# EAGLE design power_Rev_2 (EAGLE 9.0.1)
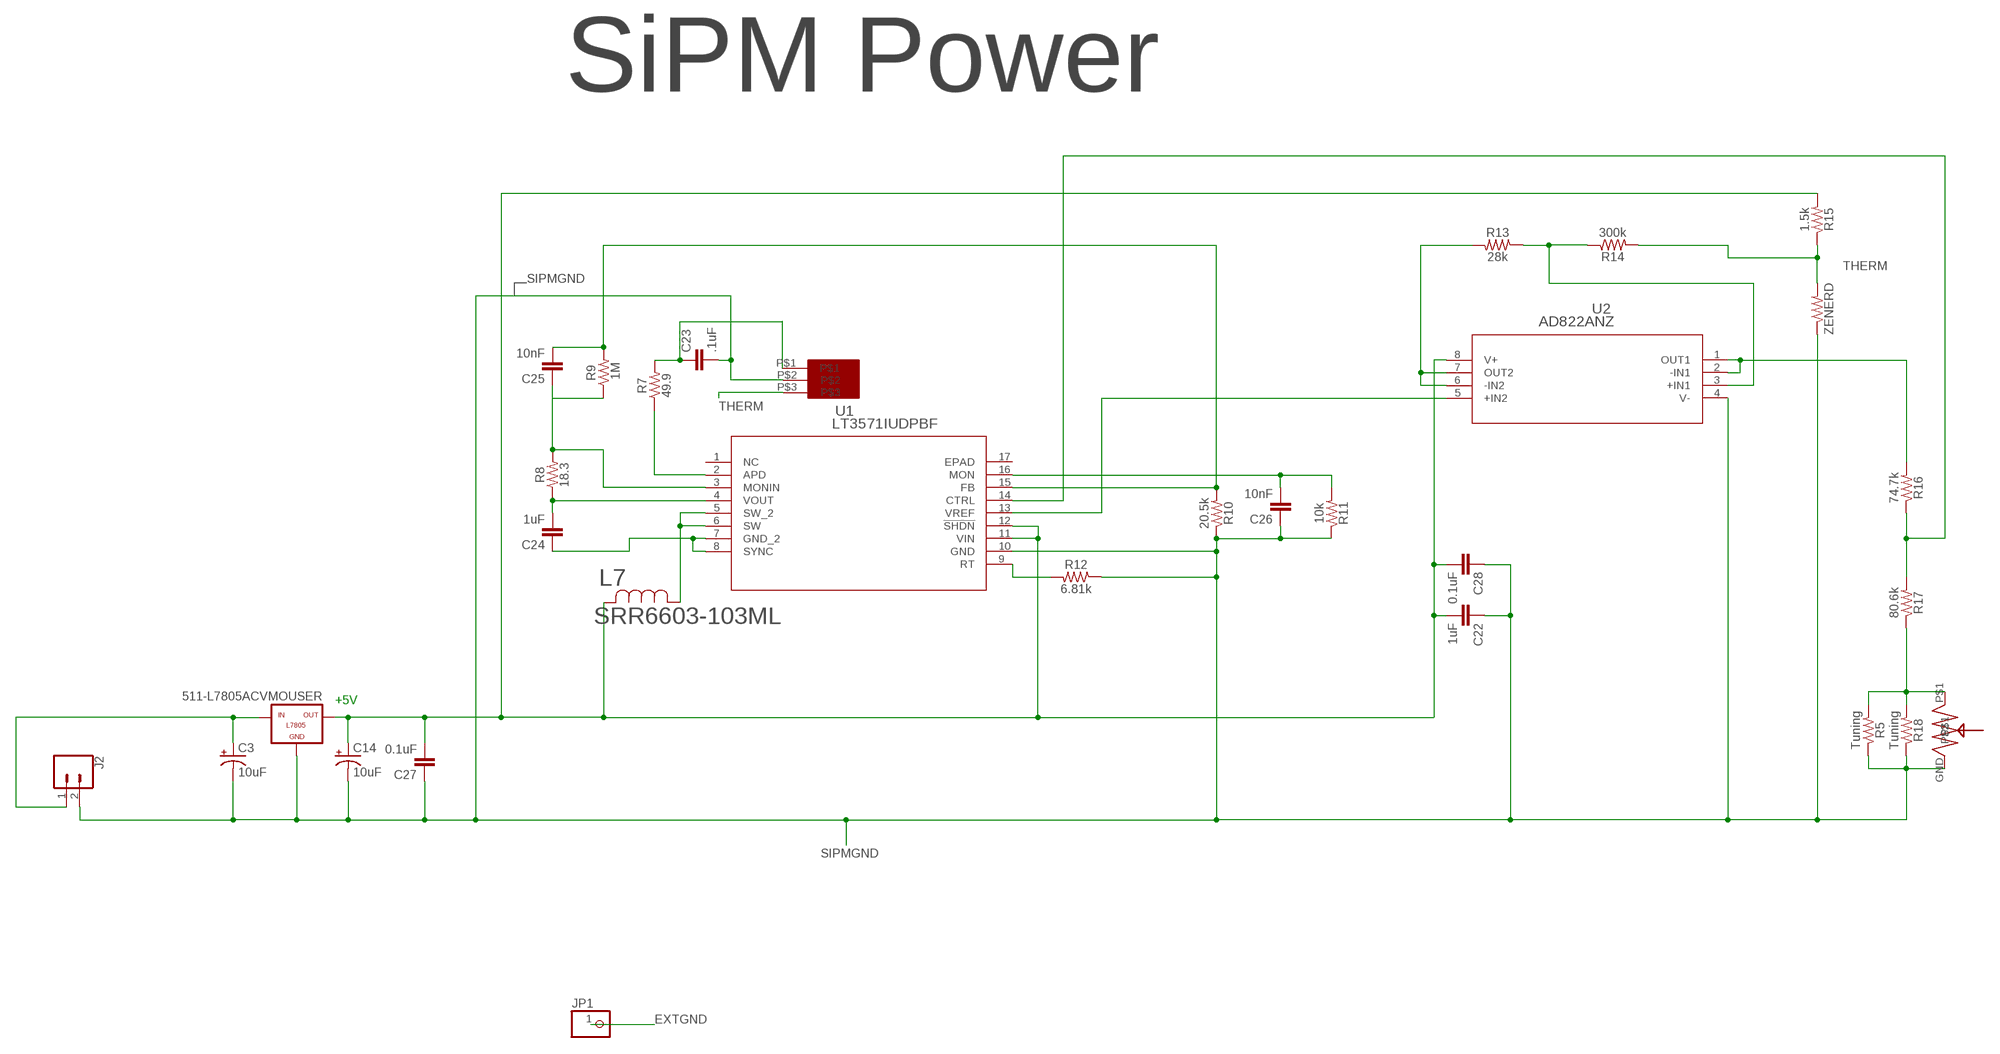
[diagram p0: schematic, sheet 1, part 1 of 2]
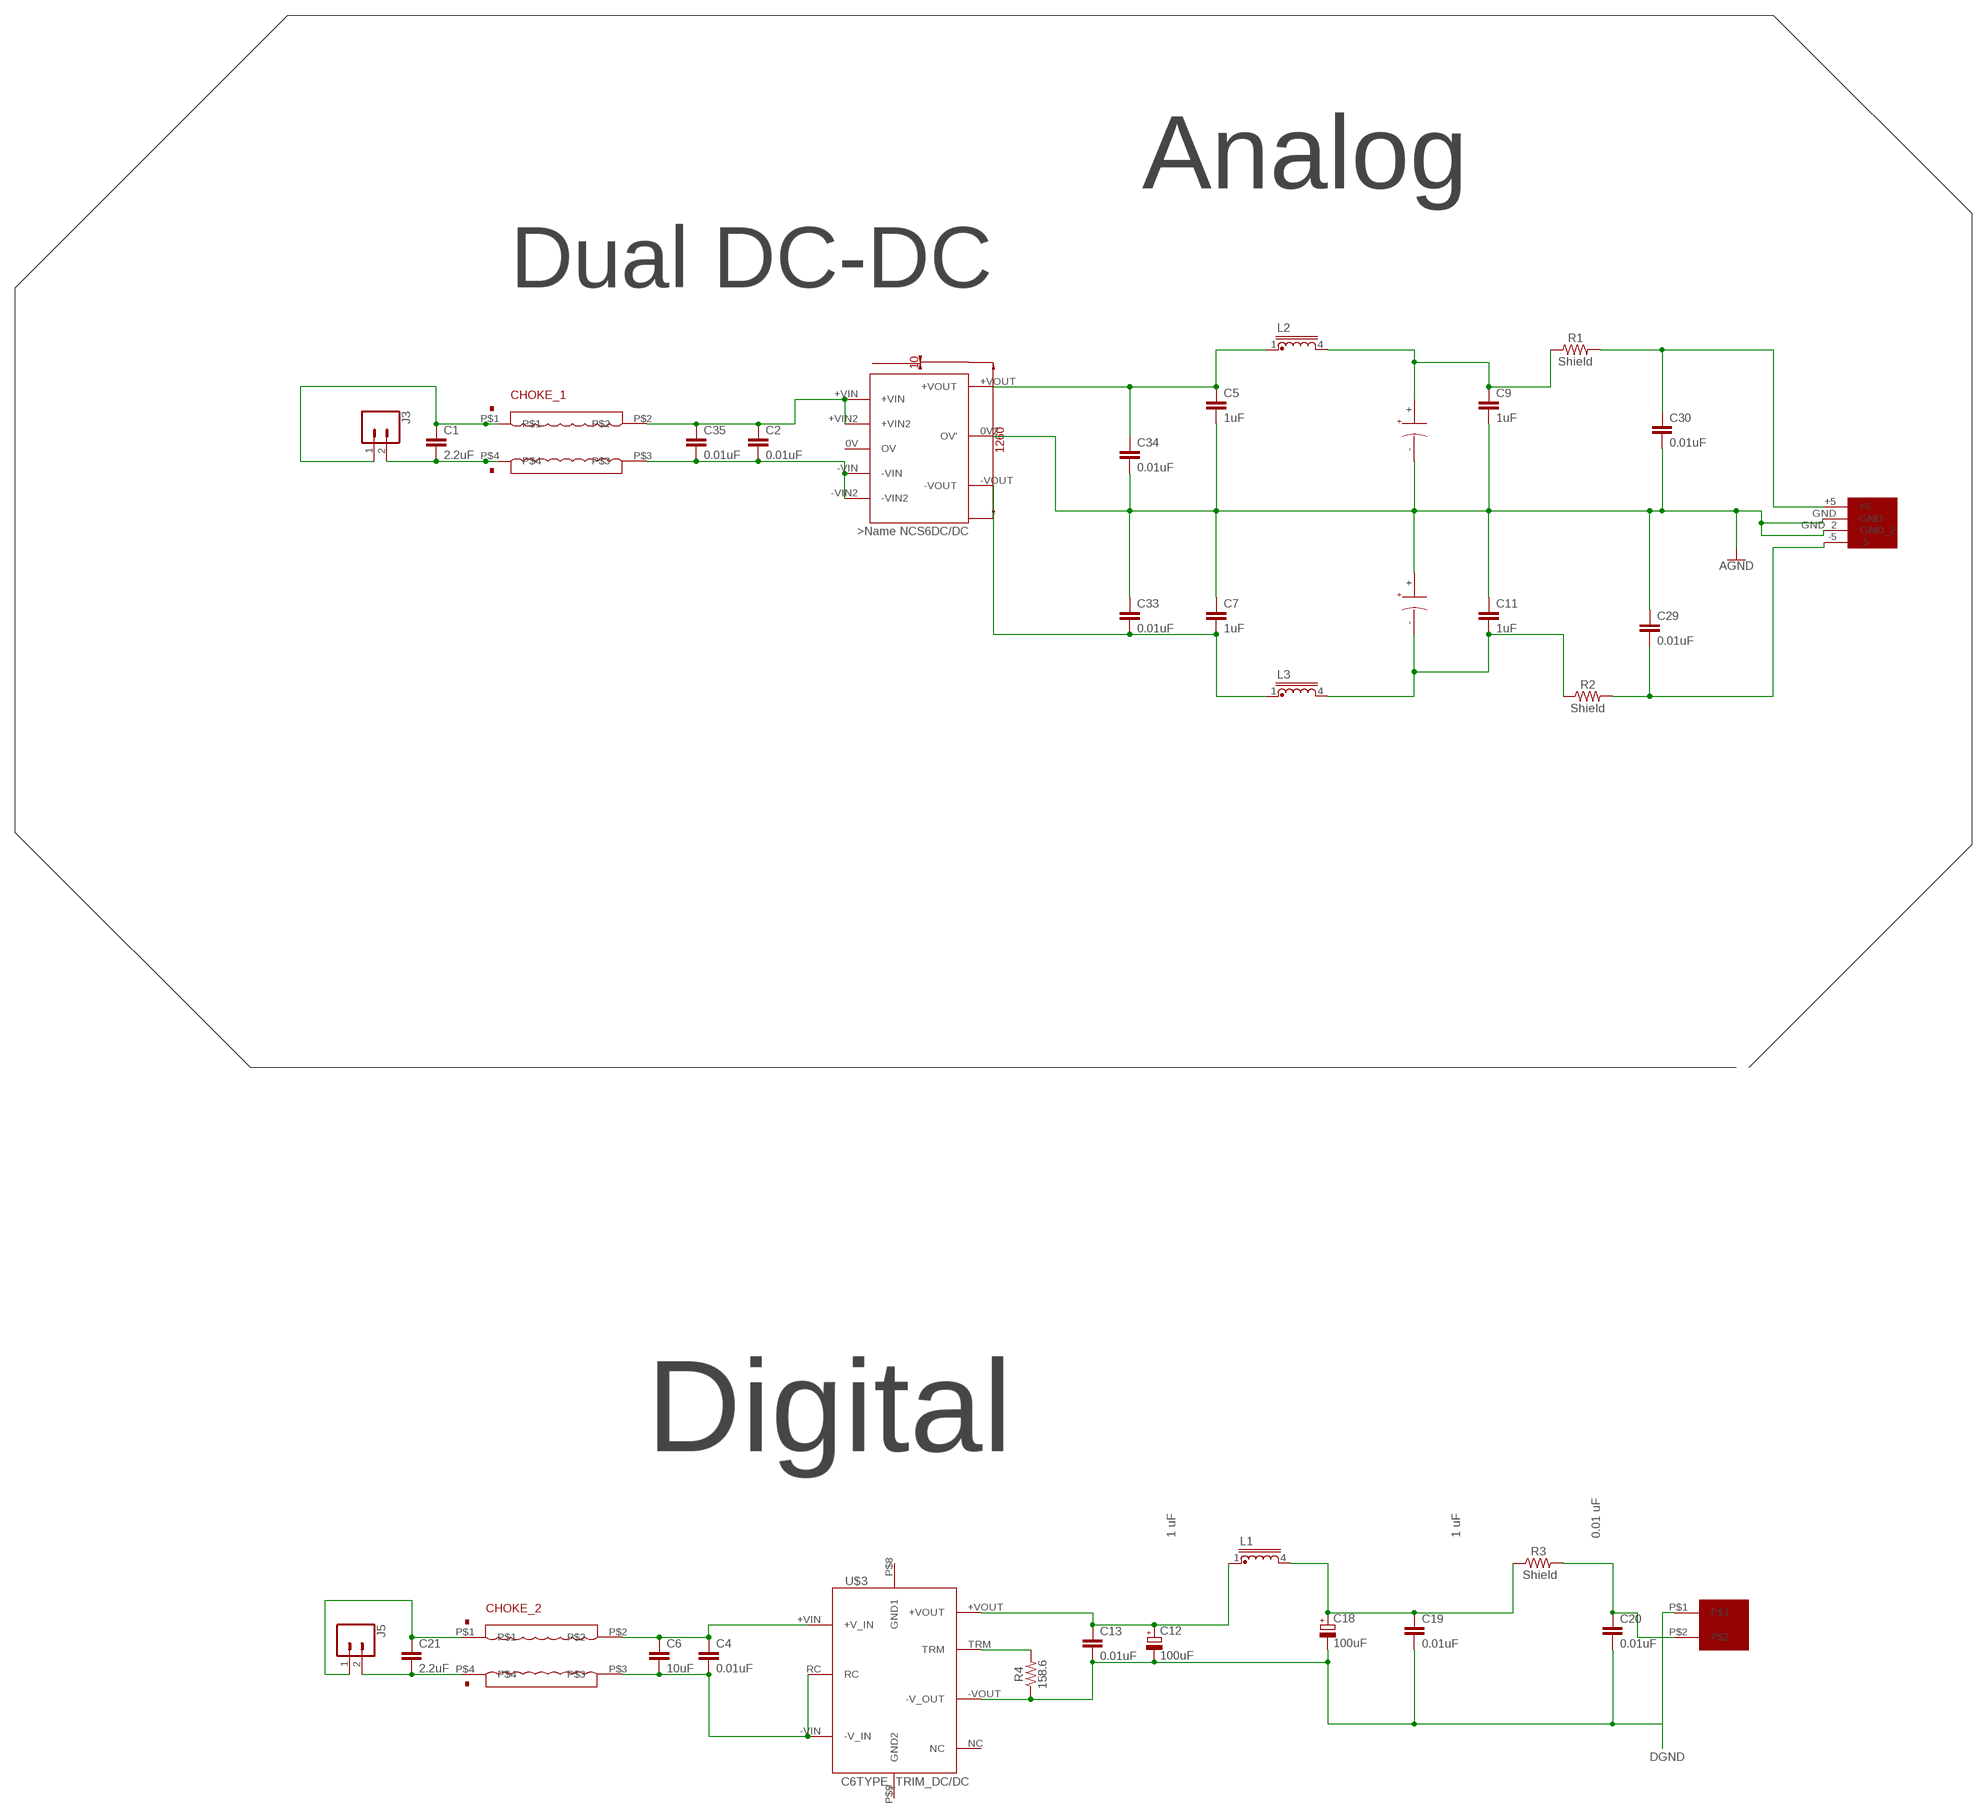
[diagram p1: schematic, sheet 1, part 2 of 2]

## Parts
511-L7805ACVMOUSER  -L7805  [L7805]
C1  2.2uF  C-EU050-024X044  [C050-024X044]
C2  0.01uF  C-EU025-025X050  [C025-025X050]
C3  10uF  CPOL-USB/3528-21R  [T/3528-12R]
C4  0.01uF  C-EU025-025X050  [C025-025X050]
C5  1uF  C-EU025-025X050  [C025-025X050]
C6  10uF  C-EU025-025X050  [C025-025X050]
C7  1uF  C-EU025-025X050  [C025-025X050]
C8  150uF  399-4567-ND  [399-3567-ND150UF]
C9  1uF  C-EU025-025X050  [C025-025X050]
C10  150uF  399-4567-ND  [399-3567-ND150UF]
C11  1uF  C-EU025-025X050  [C025-025X050]
C12  100uF  CPOL-EUC/6032-28R  [C/6032-28R]
C13  0.01uF  C-EU025-025X050  [C025-025X050]
C14  10uF  CPOL-USB/3528-21R  [T/3528-12R]
C18  100uF  CPOL-EUC/6032-28R  [C/6032-28R]
C19  0.01uF  C-EU025-025X050  [C025-025X050]
C20  0.01uF  C-EU025-025X050  [C025-025X050]
C21  2.2uF  C-EU050-024X044  [C050-024X044]
C22  1uF  C-EU025-025X050  [C025-025X050]
C23  .1uF  C2.5/2  [C2.5-2]
C24  1uF  C-EU025-025X050  [C025-025X050]
C25  10nF  C2.5/2  [C2.5-2]
C26  10nF  C2.5/2  [C2.5-2]
C27  0.1uF  C2.5/2  [C2.5-2]
C28  0.1uF  C2.5/2  [C2.5-2]
C29  0.01uF  C-EUC0603  [C0603]
C30  0.01uF  C-EUC0603  [C0603]
C33  0.01uF  C-EUC0603  [C0603]
C34  0.01uF  C-EUC0603  [C0603]
C35  0.01uF  C-EUC0603  [C0603]
CHOKE_1  DN4730-ND  [DN4730-ND]
CHOKE_2  DN4730-ND  [DN4730-ND]
J2  CONN_023.5MM  [SCREWTERMINAL-3.5MM-2]
J3  CONN_023.5MM  [SCREWTERMINAL-3.5MM-2]
J5  CONN_023.5MM  [SCREWTERMINAL-3.5MM-2]
JP1  PINHD-1X1  [1X01]
L1  U15-CHOKE  [U15CHOKE]
L2  U15-CHOKE  [U15CHOKE]
L3  U15-CHOKE  [U15CHOKE]
L7  SRR6603-103ML  [IND_BOURNS_SRR6603]
PWR_JACK  WM403_NDPOWER_JACK  [WM4302-ND]
R1  Shield  RESISTORAXIAL-0.3  [AXIAL-0.3]
R2  Shield  RESISTORAXIAL-0.3  [AXIAL-0.3]
R3  Shield  RESISTORAXIAL-0.3  [AXIAL-0.3]
R4  158.6  RESISTORAXIAL-0.3  [AXIAL-0.3]
R5  Tuning  RESISTORAXIAL-0.3  [AXIAL-0.3]
R7  49.9  RESISTORAXIAL-0.3  [AXIAL-0.3]
R8  18.3  RESISTORAXIAL-0.3  [AXIAL-0.3]
R9  1M  RESISTORAXIAL-0.3  [AXIAL-0.3]
R10  20.5k  RESISTORAXIAL-0.3  [AXIAL-0.3]
R11  10k  10KOHM-HORIZ-1/4W-1%  [AXIAL-0.3]
R12  6.81k  RESISTORAXIAL-0.3  [AXIAL-0.3]
R13  28k  RESISTORAXIAL-0.3  [AXIAL-0.3]
R14  300k  RESISTORAXIAL-0.3  [AXIAL-0.3]
R15  1.5k  RESISTORAXIAL-0.3  [AXIAL-0.3]
R16  74.7k  RESISTORAXIAL-0.3  [AXIAL-0.3]
R17  80.6k  RESISTORAXIAL-0.3  [AXIAL-0.3]
R18  Tuning  RESISTORAXIAL-0.3  [AXIAL-0.3]
U1  LT3571IUDPBF  [QFN-16_UD]
U2  AD822ANZ  [N_8]
U$1  NCS6D1205  [NCS6D1205C]
U$3  C6TYPE_TRIM_DC/DC  [CONV/DC/DC_6W_SNGL_C6TYPE]
U$4  WM4300-ND_2PIN  [WM4300-ND_2PIN]
U$5  WM4301-ND_3PIN  [WM4301-ND_3PIN]
VAR1  10KTRIM_POT  [10KTRIM_POT]
ZENERD  RESISTORAXIAL-0.3  [AXIAL-0.3]

## Nets
5VSUPPLY: 511-L7805ACVMOUSER.OUT C14.+ C22.2 C27.2 C28.2 L7.2 R15.P$2 U1.11(VIN) U1.12(!SHDN) U2.8(V+)
+VOUT: C18.+ C19.1 L1.4 R3.P$1
+VOUT': C12.+ C13.1 L1.1 U$3.+VOUT
+VOUT'': C20.1 R3.P$2 U$4.P$2
-FINV: C30.1 PWR_JACK.+5 R1.P$2
AGND: C5.2 C7.1 C8.-(N) C9.2 C10.+(P) C11.1 C29.1 C30.2 C33.1 C34.2 PWR_JACK.GND PWR_JACK.GND_2 U$1.0V2(OV')
DGND: C12.- C13.2 C18.- C19.2 C20.2 R4.P$1 U$3.-VOUT(-V_OUT) U$4.P$1
EXTGND: JP1.1
N$1: C1.1 CHOKE_1.P$1 J3.1
N$2: C1.2 CHOKE_1.P$4 J3.2
N$3: C7.2 C33.2 L3.1 U$1.-VOUT
N$4: C2.1 C35.1 CHOKE_1.P$2 U$1.+VIN U$1.+VIN2
N$6: C8.+(P) C9.1 L2.4 R1.P$1
N$7: R13.P$2 U2.6(-IN2) U2.7(OUT2)
N$8: C10.-(N) C11.2 L3.4 R2.P$1
N$9: C29.2 PWR_JACK.-5 R2.P$2
N$10: C21.1 CHOKE_2.P$1 J5.1
N$11: C21.2 CHOKE_2.P$4 J5.2
N$12: C4.1 C6.1 CHOKE_2.P$2 U$3.+VIN(+V_IN)
N$13: C4.2 C6.2 CHOKE_2.P$3 U$3.-VIN(-V_IN) U$3.RC
N$14: C24.2 R8.P$1 U1.4(VOUT)
N$16: R4.P$2 U$3.TRM
N$18: C24.1 U1.7(GND_2) U1.8(SYNC)
N$20: R7.P$1 U1.2(APD)
N$21: C23.1 R7.P$2 U$5.P$1
N$22: C25.1 R8.P$2 R9.P$1 U1.3(MONIN)
N$23: C26.2 R11.P$2 U1.16(MON)
N$24: L7.1 U1.5(SW_2) U1.6(SW)
N$25: U1.13(VREF) U2.5(+IN2)
N$26: C5.1 C34.1 L2.1 U$1.+VOUT
N$27: R16.P$2 U2.1(OUT1) U2.2(-IN1)
N$28: C25.2 R9.P$2 R10.P$2 U1.15(FB)
N$29: R13.P$1 R14.P$1 U2.3(+IN1)
N$30: R12.P$2 U1.9(RT)
N$33: R16.P$1 R17.P$2 U1.14(CTRL)
N$34: R5.P$2 R17.P$1 R18.P$2 VAR1.P$1
N$35: C2.2 C35.2 CHOKE_1.P$3 U$1.-VIN U$1.-VIN2
N$36: 511-L7805ACVMOUSER.IN C3.+ J2.1
SIPMGND: 511-L7805ACVMOUSER.GND C3.- C14.- C22.1 C23.2 C26.1 C27.1 C28.1 J2.2 R5.P$1 R10.P$1 R11.P$1 R12.P$1 R18.P$1 U1.10(GND) U2.4(V-) U$5.P$2 VAR1.GND ZENERD.P$1
THERM: R14.P$2 R15.P$1 U$5.P$3 ZENERD.P$2
Unconnected: U1.1(NC) U1.17(EPAD) U$1.0V(OV) U$3.NC U$3.P$8(GND1) U$3.P$9(GND2)

## Notes on the sheet
- SiPM Power
- +5V
- Analog
- Dual DC-DC
- Digital
- 1 uF | 1 uF
- 0.01 uF

## Library data of the parts
511-L7805ACVMOUSER = tango:-L7805; OC_NEWARK: unknown
C1 C2 C4-C7 C9 C11 C13 C19-C22 C24 = resistor:C-EU: CAPACITOR, European symbol; OC_NEWARK: unknown
C3 C14 = resistor:CPOL-US: POLARIZED CAPACITOR, American symbol
C8 C10 = 399-3567-ND150uF:399-4567-ND
C12 = resistor:CPOL-EU: POLARIZED CAPACITOR, European symbol; OC_NEWARK: unknown
C18 = resistor:CPOL-EU: POLARIZED CAPACITOR, European symbol; OC_NEWARK: unknown; SPICEPREFIX: C
C23 C25-C28 = capacitor-wima:C: CAPACITOR naming: grid - package width; OC_NEWARK: unknown
C29 C30 C33-C35 = resistor:C-EU: CAPACITOR, European symbol
CHOKE_1 CHOKE_2 = DN4730-ND_Com_Choke:DN4730-ND: Surface Mount Common Mode Choke Digikey: DN4730-ND 100uH
J2 J3 J5 = SparkFun-Connectors:CONN_02: Multi connection point. Often used as Generic Header-pin footprint for 0.1 inch spaced/style header connections On any of the 0.1 inch spaced packages, you can populate with these: Break Away Headers - Straight <https://www.sparkfun.com/products/116> (PRT-00116) Break Away Male Headers - Right Angle <https://www.sparkfun.com/products/553> (PRT-00553) Female Headers <https://www.sparkfun.com/products/115> (PRT-00115) Break Away Headers - Machine Pin <https://www.sparkfun.com/products/117> (PRT-00117) Break Away Female Headers - Swiss Machine Pin <https://www.sparkfun.com/products/743> (PRT-00743) For SCREWTERMINALS and SPRING TERMINALS visit here: Screw Terimnals on SparkFun.com <https://www.sparkfun.com/search/results?term=Screw+Terminals> (5mm/3.5mm/2.54mm spacing) This device is also useful as a general connection point to wire up your design to another part of your project. Our various solder wires solder well into these plated through hole pads. Hook-Up Wire - Assortment (Stranded, 22 AWG) <https://www.sparkfun.com/products/11375> (PRT-11375) Hook-Up Wire - Assortment (Solid Core, 22 AWG) <https://www.sparkfun.com/products/11367> (PRT-11367) View the entire wire category on our website here <https://www.sparkfun.com/categories/141> Special notes: Molex polarized connector foot print use with: PRT-08233 with associated crimp pins and housings. 2.54_SCREWTERM for use with PRT-10571. 3.5mm Screw Terminal footprints for PRT-08084 5mm Screw Terminal footprints for use with PRT-08432; PROD_ID: CONN-08399
JP1 = adafruit:PINHD-1X1: Pin header 1x1 for 0.1" spacing With round pins; OC_NEWARK: unknown
L1-L3 = inductor-neosid:U15-: CHOKE U15; OC_FARNELL: unknown; OC_NEWARK: unknown
L7 = SRR6603-10MLTR-ND:SRR6603-103ML; MANUFACTURER_PART_NUMBER: SRR6603103ML; OC_NEWARK: unknown; VENDOR: Bourns Electronics
PWR_JACK = WM4302-ND:WM403_ND; OC_NEWARK: unknown
R1-R5 R7-R10 R12-R18 ZENERD = SparkFun-Resistors:RESISTOR: Generic Resistor Package; OC_NEWARK: unknown
R11 = SparkFun-Resistors:10KOHM: 10kΩ resistor A resistor is a passive two-terminal electrical component that implements electrical resistance as a circuit element. Resistors act to reduce current flow, and, at the same time, act to lower voltage levels within circuits. - Wikipedia; OC_NEWARK: unknown; PROD_ID: RES-12183
U1 = LT3571:LT3571IUDPBF; MANUFACTURER_PART_NUMBER: LT3571IUD#PBF; OC_NEWARK: unknown; VENDOR: Linear Technology
U2 = AD822ANZ_opAmp:AD822ANZ; MANUFACTURER_PART_NUMBER: AD822ANZ; OC_NEWARK: unknown; VENDOR: Analog Devices Inc
U$1 = LAFTRPWR:NCS6D1205: NCS6 DC/DC converter; OC_NEWARK: unknown
U$3 = DCDC_Trim:C6TYPE_TRIM_DC/DC; OC_NEWARK: unknown
U$4 = WM4300-ND_2PIN:WM4300-ND_2PIN
U$5 = WM4301-ND_3PIN:WM4301-ND_3PIN
VAR1 = 10kTrimPot:10KTRIM_POT

## Board
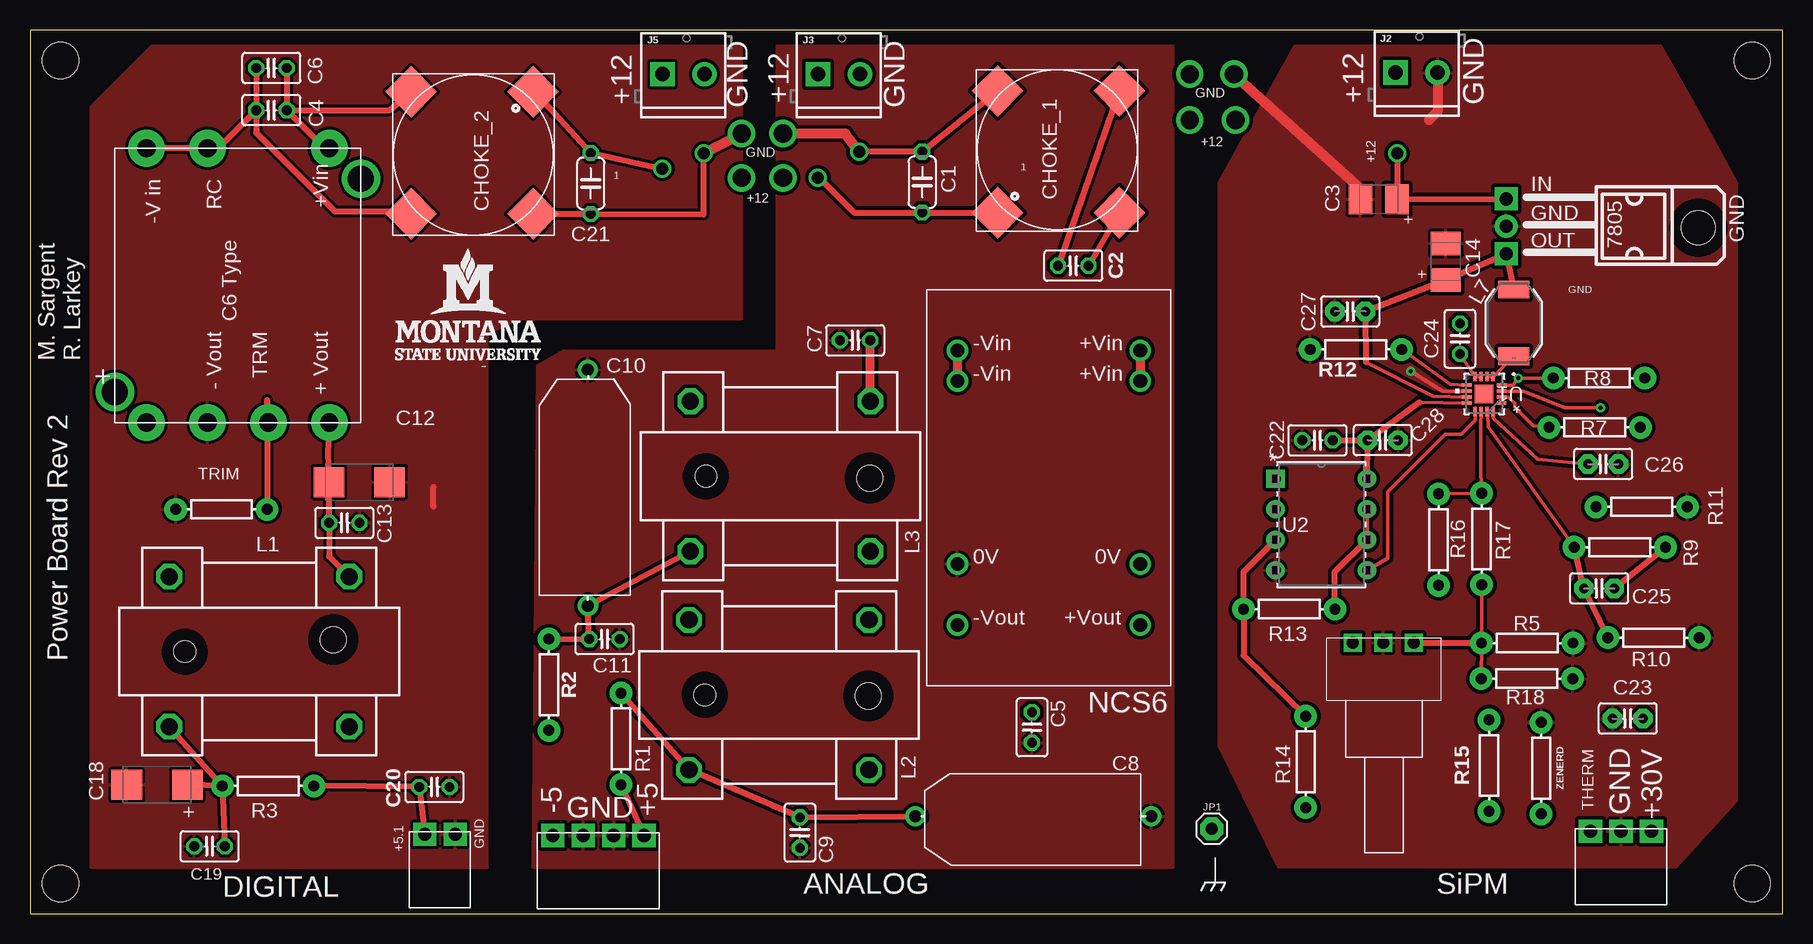
[diagram p2: board, top side]
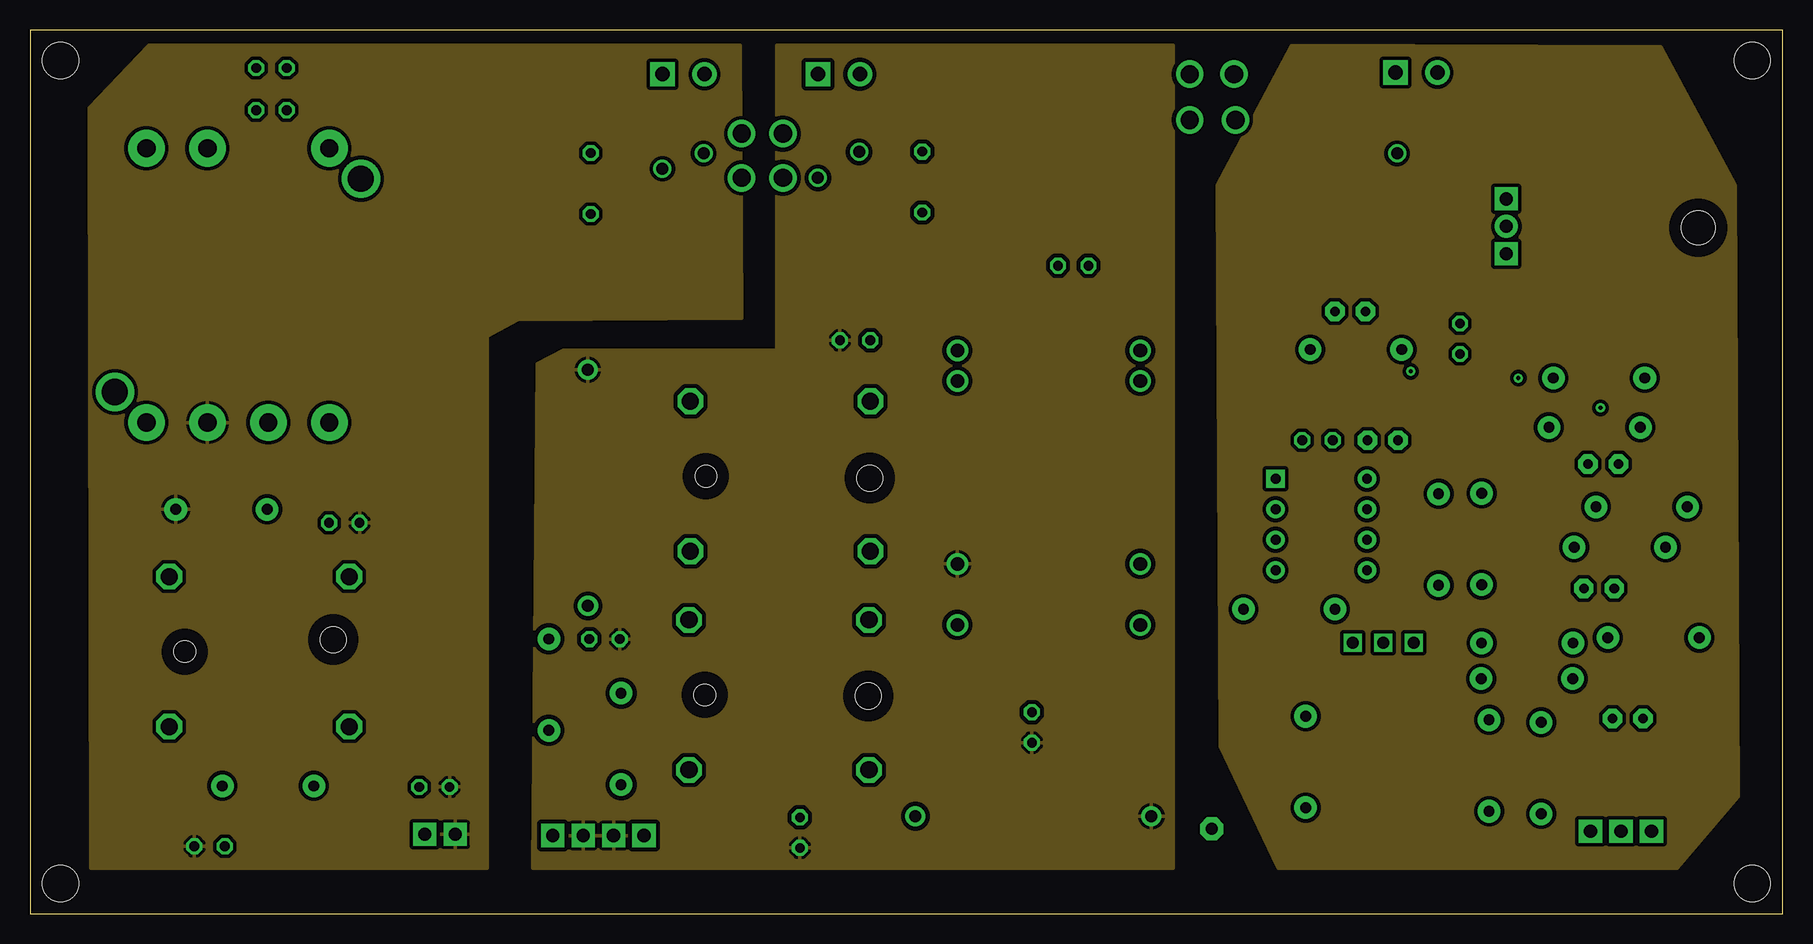
[diagram p3: board, inner layer Route2]
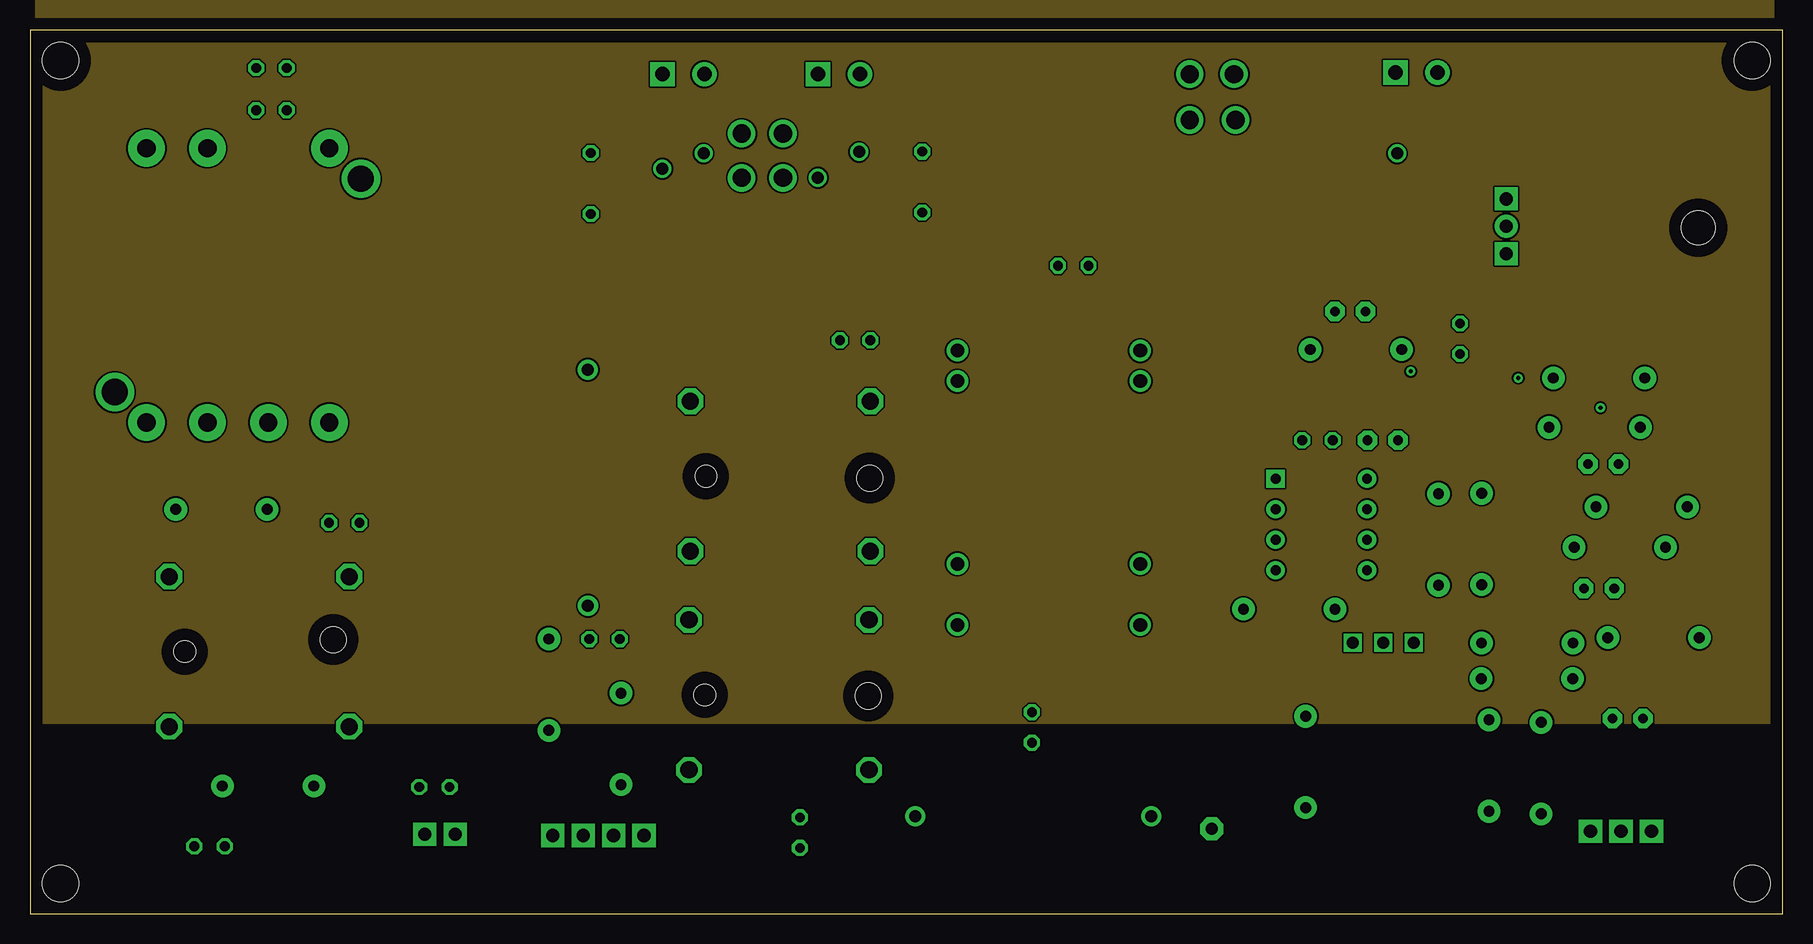
[diagram p4: board, inner layer Route15]
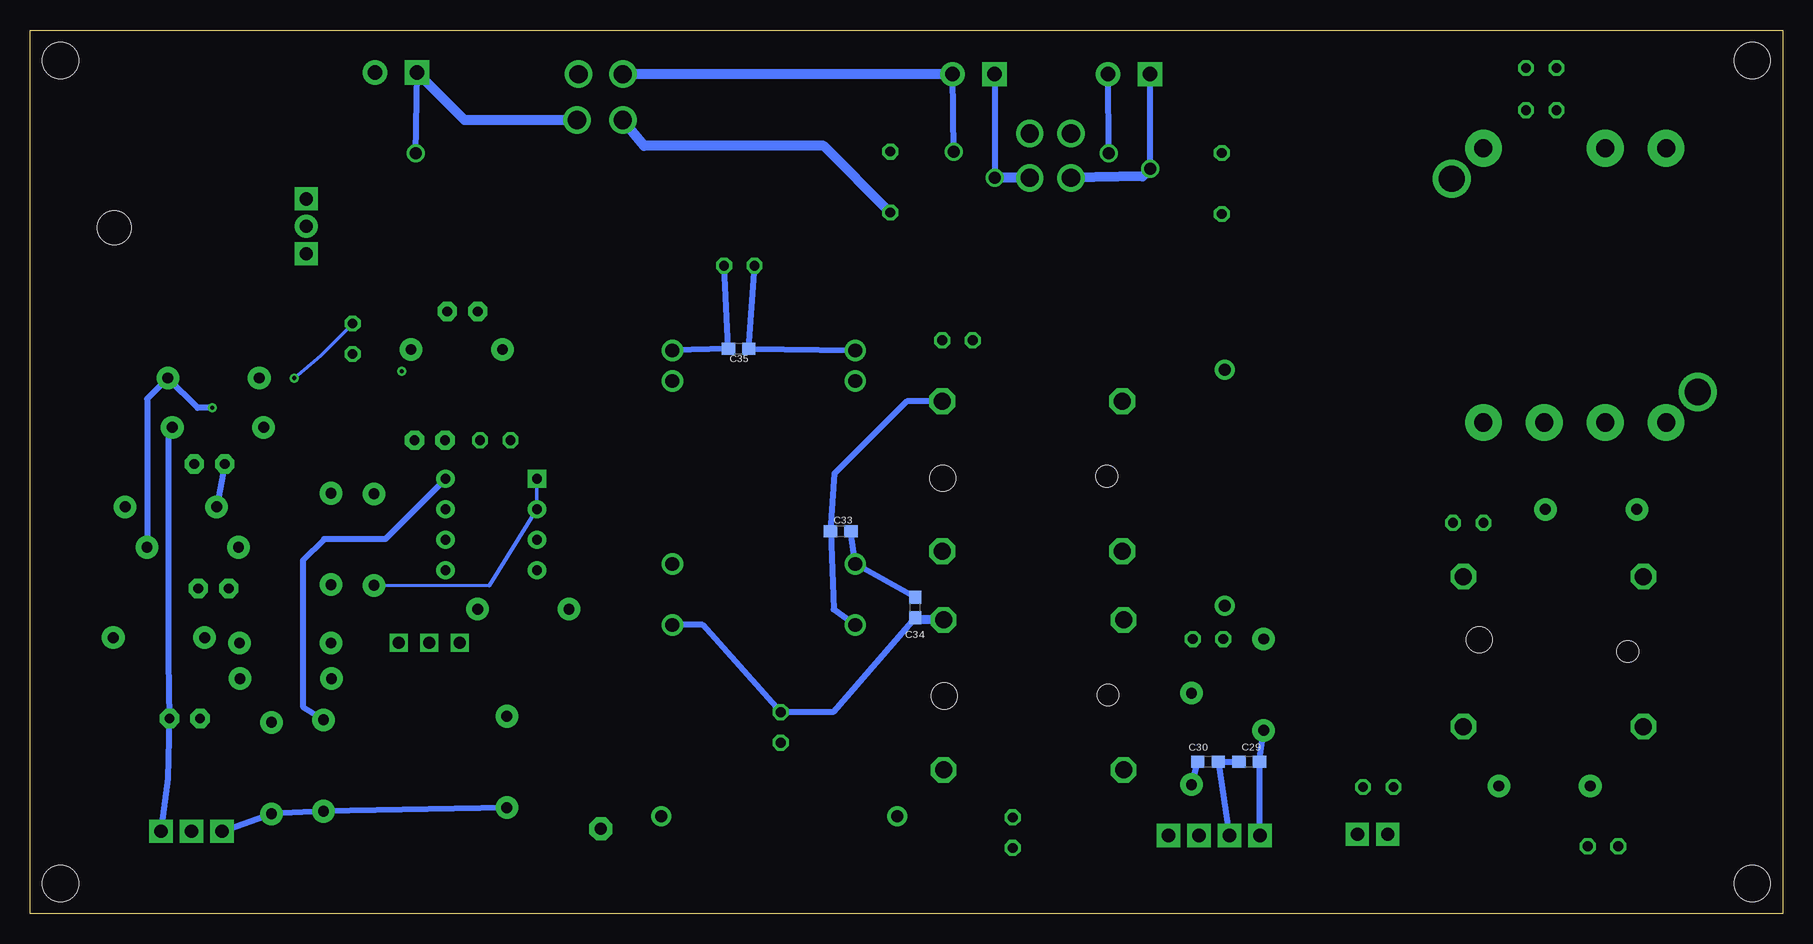
[diagram p5: board, bottom side, seen from below]

Size 146.05 x 73.66 mm. Coordinates in mm from the lower left corner, seen from the top.
Outline: 0,0 146.05,0 146.05,73.66 0,73.66 0,0
Copper layers (1*2+15*16): Top 0.035mm / dielectric 1.5mm / Route2 0.035mm / dielectric 0.15mm / Route15 0.035mm / dielectric 0.2mm / Bottom 0.035mm
Design rules "default *": minimum track width 6mil, minimum drill 0.35mm, track to track 6mil, track to pad 6mil, pad to pad 6mil, via to via 6mil, smd to smd 6mil, copper to edge 40mil, drill to drill 6mil, minimum pad ring 10mil, minimum via ring 8mil, stop-mask expansion 4mil, vias tented up to drill 0mil, thermal gap 10mil
Holes 3 mm at 2.54,71.12 2.54,2.54 143.51,2.54 143.51,71.12
Holes 2.16 mm at 69.98,36.32 69.85,18.16 25.27,22.86

### Footprints (pad centres in the part's own frame; a part is rotated, then mirrored left to right if it is on the bottom)
L7805 = drill 1.1 pad 1.93: GND 0.127,-9.652 | drill 1.1 pad 1.93 square: IN -2.159,-9.652; OUT 2.413,-9.652 | hole 2.8: 0.254,6.35
C050-024X044 = drill 0.813 octagon: 1 -2.54,0; 2 2.54,0
C025-025X050 = drill 0.813 octagon: 1 -1.27,0; 2 1.27,0
T/3528-12R = smd 1.95 x 2.5: + 1.525,0; - -1.525,0
399-3567-ND150UF = drill 1 pad 1.676: + 18.8,3.55; - -0.87,3.54
C/6032-28R = smd 2.55 x 2.5: + 2.525,0; - -2.525,0
C2.5-2 = drill 0.813 pad 1.6 octagon: 1 -1.27,0; 2 1.27,0
C0603 = smd 1.1 x 1: 1 -0.85,0; 2 0.85,0
DN4730-ND = smd 3.048 x 3.048 rotated 45: P$1 1.524,11.684; P$2 1.524,1.524 | smd 3.048 x 3.048 rotated 225: P$3 11.684,1.524; P$4 11.684,11.684
SCREWTERMINAL-3.5MM-2 = drill 1.2 pad 2.032 square: 1 0,0 | drill 1.2 pad 2.032: 2 3.5,0
1X01 = drill 1.016 pad 1.93 octagon: 1 0,0
U15CHOKE = drill 1.422 octagon: 1 -7.5,-6.25; 4 7.5,6.25; U2 -7.5,6.25; U3 7.5,-6.25 | hole 1.8: 6.2,0
IND_BOURNS_SRR6603 = smd 1.46 x 2.591: 1 -2.775,0; 2 2.775,0
WM4302-ND = drill 1.1 pad 1.93 square: +5 1.27,0.23; -5 8.89,0.23; GND 3.81,0.23; GND_2 6.35,0.23
AXIAL-0.3 = drill 0.9 pad 1.88: P$1 -3.81,0; P$2 3.81,0
QFN-16_UD = smd 0.805 x 0.3: 1 -1.452,0.75; 2 -1.452,0.25; 3 -1.452,-0.25; 4 -1.452,-0.75; 9 1.452,-0.75; 10 1.452,-0.25; 11 1.452,0.25; 12 1.452,0.75 | smd 0.3 x 0.805: 5 -0.75,-1.452; 6 -0.25,-1.452; 7 0.25,-1.452; 8 0.75,-1.452; 13 0.75,1.452; 14 0.25,1.452; 15 -0.25,1.452; 16 -0.75,1.452 | smd 1.55 x 1.55: 17 0,0
N_8 = drill 0.813 pad 1.524 square: 1 -7.62,7.62 | drill 0.813 pad 1.524: 2 -7.62,5.08; 3 -7.62,2.54; 4 -7.62,0; 5 0,0; 6 0,2.54; 7 0,5.08; 8 0,7.62
NCS6D1205C = drill 1.143 pad 1.778: 0V 17.78,15.24; 0V2 17.78,0; +VIN 0,15.24; +VIN2 2.54,15.24; +VOUT 22.86,15.24; -VIN 0,0; -VIN2 2.54,0; -VOUT 22.86,0
CONV/DC/DC_6W_SNGL_C6TYPE = drill 1.524 pad 3.048: +VIN 0,17.87; +VOUT 22.86,17.87; -VIN 0,2.63; -VOUT 22.86,7.71; NC 22.86,2.63; RC 0,7.71; TRM 22.86,12.79 | drill 2.184 pad 3.048: P$8 2.54,20.5; P$9 20.32,0
WM4300-ND_2PIN = drill 1.1 pad 1.93 square: P$1 -1.27,-3.58; P$2 1.27,-3.58
WM4301-ND_3PIN = drill 1.1 pad 1.93 square: P$1 1.27,0.23; P$2 3.81,0.23; P$3 6.35,0.23
10KTRIM_POT = drill 1 square: GND 4.83,0.38; P$1 2.29,0.38; P$3 7.37,0.38

### Placement (x,y rotation side)
511-L7805ACVMOUSER  132.68,57.43 270 top
C1  74.36,60.99 90 top
C2  86.94,54.02 180 top
C3  112.4,59.56 0 top
C4  20.12,66.98 180 top
C5  83.49,15.54 270 top
C6  20.12,70.49 180 top
C7  68.76,47.8 0 top
C8  92.58,11.68 180 top
C9  64.16,6.77 270 top
C10  50.04,26.54 90 top
C11  47.88,22.9 180 top
C12  27.44,35.98 180 top
C13  26.19,32.59 0 top
C14  117.98,54.36 270 top
C18  10.59,10.76 0 top
C19  14.97,5.63 180 top
C20  33.7,10.58 0 top
C21  46.73,60.87 270 top
C22  107.28,39.47 0 top
C23  133.15,16.28 180 top
C24  119.17,47.93 90 top
C25  130.76,27.12 180 top
C26  131.1,37.49 180 top
C27  110.02,50.21 0 top
C28  112.73,39.48 180 top
C29  44.45,12.7 0 bottom
C30  47.88,12.7 0 bottom
C33  78.49,31.88 180 bottom
C34  72.26,25.53 90 bottom
C35  87,47.12 0 bottom
CHOKE_1  92.31,56.9 90 top
CHOKE_2  30.24,70.03 270 top
J2  113.79,70.1 0 top
J3  65.66,69.98 0 top
J5  52.7,69.98 0 top
JP1  98.48,7.09 270 top
L1  19.11,21.86 180 top
L2  62.42,18.25 180 top
L3  62.53,36.47 180 top
L7  123.65,49.25 90 top
PWR_JACK  52.44,6.76 180 top
R1  49.26,14.58 270 top
R2  43.24,19.1 270 top
R3  19.84,10.67 0 top
R4  15.96,33.72 0 top
R5  124.78,22.58 180 top
R7  130.39,40.55 0 top
R8  130.75,44.66 0 top
R9  132.49,30.55 180 top
R10  135.3,23.02 180 top
R11  134.31,33.93 180 top
R12  110.49,47.04 0 top
R13  104.94,25.4 0 top
R14  106.31,12.66 270 top
R15  121.59,12.37 90 top
R16  117.38,31.19 270 top
R17  120.97,31.24 90 top
R18  124.74,19.61 180 top
U1  121.18,43.33 180 top
U2  111.42,28.64 0 top
U$1  77.28,46.95 270 top
U$3  7.07,63.81 270 top
U$4  34.16,3.05 180 top
U$5  136.4,7.11 180 top
VAR1  117.6,22.99 180 top
ZENERD  125.93,12.15 270 top

### Tracks (layer width: path | path; a pad name or v marks a point on that pad's centre or on a via)
5VSUPPLY
  Top 0.305: 115.78,42.62 U1.12 U1.11 116.94,43.12 111.32,45.99
  Top 0.508: C22.2 C28.2 | C28.2 115.78,42.62 | U2.8 C28.2 | 111.32,45.99 C27.2 C14.+ 511-L7805ACVMOUSER.OUT L7.2
  Bottom 0.508: 111.56,36.4 U2.8 116.44,31.24 121.54,31.24 123.32,29.46 123.32,17.27 R15.P$2
+VOUT
  Top 0.508: L1.4 R3.P$1 | R3.P$1 C19.1 | R3.P$1 C18.+
+VOUT'
  Top 0.508: U$3.+VOUT 24.82,38.49 C12.+ 24.91,32.98 C13.1 24.93,29.8 L1.1
+VOUT''
  Top 0.508: R3.P$2 C20.1 U$4.P$2
-FINV
  Top 0.508: R1.P$2 PWR_JACK.+5
  Bottom 0.508: R1.P$2 C30.1
AGND
  Bottom 0.508: C29.1 C30.2 PWR_JACK.GND_2 | C33.1 U$1.0V2 C34.2
  pour Route2 (isolate 0.356): 62.23,72.39 62.23,46.99 44.45,46.99 42.29,45.85 41.91,3.81 95.25,3.81 95.25,72.39
  pour Top (isolate 0.305): 62.23,72.39 95.25,72.39 95.25,3.81 41.91,3.81 42.29,45.72 44.45,46.99 62.23,46.99
DGND
  Top 0.508: 33.62,33.96 33.62,35.56
  pour Route2 (isolate 0.305): 59.18,72.39 59.31,49.66 40.64,49.53 38.1,48.13 38.1,3.81 5.08,3.81 4.95,67.18 9.91,72.39
  pour Top (isolate 0.254): 5.08,67.31 10.16,72.39 59.31,72.39 59.31,49.53 40.64,49.53 38.1,48.26 38.1,3.81 5.08,3.81
EXTGND
  pour Route15: 0.51,88.27 145.29,88.27 145.29,15.88 0.51,15.88
N$1  (via drill 1, 1.52)
  Top 0.508: v65.66,61.34 65.66,61.47 68.68,58.45 C1.1 CHOKE_1.P$1
  Bottom 0.508: J3.1 v65.66,61.34
  Bottom 0.813: v62.74,61.34 v65.66,61.34 | C1.1 79.92,64.01 94.87,64.01 v96.65,66.17
N$2  (via drill 1, 1.52)
  Top 0.508: v69.09,63.5 C1.2 CHOKE_1.P$4
  Top 0.813: v69.09,63.5 67.95,65.02 v62.74,65.02
  Bottom 0.508: v69.09,63.5 J3.2
  Bottom 0.813: J3.2 v96.65,69.98
N$3
  Top 0.762: L3.1 C7.2
  Bottom 0.508: L3.1 72.98,42.72 78.99,36.7 C33.2 79.08,25.38 U$1.-VOUT
N$4
  Top 0.508: CHOKE_1.P$2 C2.1
  Top 0.762: U$1.+VIN U$1.+VIN2
  Bottom 0.508: U$1.+VIN 92.48,46.99 C35.1 C2.1
N$6
  Top 0.508: R1.P$1 L2.4 C9.1 C8.+
N$7
  Top 0.305: U2.6 U2.7
  Top 0.508: R13.P$2 108.75,28.5 U2.6
N$8
  Top 0.508: R2.P$1 C11.2 C10.- L3.4
N$9
  Bottom 0.508: PWR_JACK.-5 43.6,8.11 C29.2 R2.P$2
N$10  (via drill 1, 1.52)
  Top 0.508: CHOKE_2.P$1 43.71,66.71 C21.1 v52.7,62.1
  Bottom 0.508: v52.7,62.1 J5.1
  Bottom 0.813: v52.7,62.1 53.34,61.47 v59.31,61.34
N$11  (via drill 1, 1.52)
  Top 0.508: CHOKE_2.P$4 C21.2 56.13,58.29 v56.13,63.37
  Top 0.813: v56.13,63.37 v59.31,65.02
  Bottom 0.508: v56.13,63.37 J5.2
N$12
  Top 0.508: C6.1 C4.1 | C4.1 29.98,66.98 CHOKE_2.P$2 | C4.1 24.56,63.81 U$3.+VIN
N$13
  Top 0.508: U$3.-VIN U$3.RC 15.67,63.81 C4.2 | C6.2 C4.2 | C4.2 18.85,65.1 25.4,58.55 31.71,58.55 CHOKE_2.P$3
N$14  (via drill 0.35)
  Top 0.305: R8.P$1 v124.03,44.65 123.58,44.08 U1.4
  Bottom 0.305: v124.03,44.65 121.82,46.52 120.79,47.55 C24.2
N$16
  Top 0.508: U$3.TRM 19.77,42.82 R4.P$2
N$18
  Top 0.305: U1.7 U1.8 C24.1
N$20
  Top 0.305: U1.2 123.19,43.08 123.72,42.54 123.72,42.24 125.28,40.68 R7.P$1
N$21
  Bottom 0.508: R7.P$2 134.49,40.26 134.49,21.16 C23.1 134.54,11.25 U$5.P$1
N$22  (via drill 0.35)
  Top 0.305: U1.3 124.46,43.56 127.89,42.16 v130.87,42.17
  Top 0.508: C25.1 R9.P$1
  Bottom 0.508: v130.87,42.17 132.08,42.17 R8.P$2 136.3,42.92 R9.P$1
N$23
  Top 0.305: U1.16 121.93,41.32 125.63,37.87 C26.2
  Bottom 0.508: C26.2 R11.P$2
N$24
  Top 0.305: U1.6 U1.5 L7.1
N$25
  Top 0.305: U1.13 120.43,41.16 119.26,39.99 117.95,39.99 113.16,35.19 113.16,29.65 U2.5
N$26
  Bottom 0.508: 72.16,24.5 C34.1 | C34.1 72.26,24.52 72.38,24.64 | U$1.+VOUT 90.01,24.09 C5.1 79.11,16.81 C34.1
  Bottom 0.762: L2.1 72.16,24.5
N$27
  Bottom 0.305: U2.1 U2.2 107.77,27.36 R16.P$2
N$28
  Top 0.305: R9.P$2 121.5,40.6 121.5,41.1 121.47,41.13 121.47,41.83 U1.15
  Top 0.508: R9.P$2 C25.2 R10.P$2
N$29
  Top 0.305: 103.78,31.15 U2.3
  Top 0.508: 103.78,31.15 101.13,28.5 R13.P$1 101.13,21.53 R14.P$1
N$30
  Top 0.305: R12.P$2 118.34,44.12 U1.9
N$33
  Top 0.305: R16.P$1 R17.P$2 120.91,36.77 120.91,40.62 | 120.91,40.62 U1.14 | 120.91,40.62
N$34
  Top 0.305: R18.P$2 R5.P$2 R17.P$1
  Top 0.508: VAR1.P$1 120.93,22.61 R5.P$2
N$35
  Top 0.508: CHOKE_1.P$3 C2.2
  Top 0.762: U$1.-VIN U$1.-VIN2
  Bottom 0.508: U$1.-VIN 77.32,46.99 C35.2 C2.2
N$36  (via drill 1, 1.52)
  Top 0.508: 511-L7805ACVMOUSER.IN C3.+ v113.92,63.37
  Bottom 0.508: v113.92,63.37 J2.1
  Bottom 0.813: 113.67,69.98 J2.1 109.86,66.17 v100.46,66.17
OUT_GND
  pour Route2 (isolate 0.305): 135.89,72.26 142.11,60.71 142.37,9.78 137.29,3.81 104.02,3.8 99.19,13.97 98.93,60.71 105.16,72.39
SIPMGND  (via drill 0.35, 1.52)
  Top 0.305: U1.10 117.71,43.58 v115.06,45.21
  Top 0.813: J2.2 117.29,66.87 116.59,66.17 | C3.- 110.87,60.45 v100.33,69.98
  pour Top (isolate 0.305): 105.41,72.39 135.89,72.39 138.48,67.86 142.24,60.96 142.24,9.4 137.16,3.81 137.16,3.81 104.04,3.86 99.06,13.97 99.06,60.96
THERM
  Bottom 0.508: R14.P$2 R15.P$1 ZENERD.P$2 U$5.P$3

### Text on the board
tPlace: M. Sargent / R. Larkey | + | Power Board Rev 2
tNames: GND | +12 | +12 | +12 | GND | GND | GND | +12 | GND | 1 | +12 | 1 | +12 | + | + | GND | TRIM | NCS6 | THERM | + | -5 | GND | +5 | GND | +30V | +5.1 | GND | DIGITAL | ANALOG | SiPM
tSilk: +Vin | +Vin | Analog Power